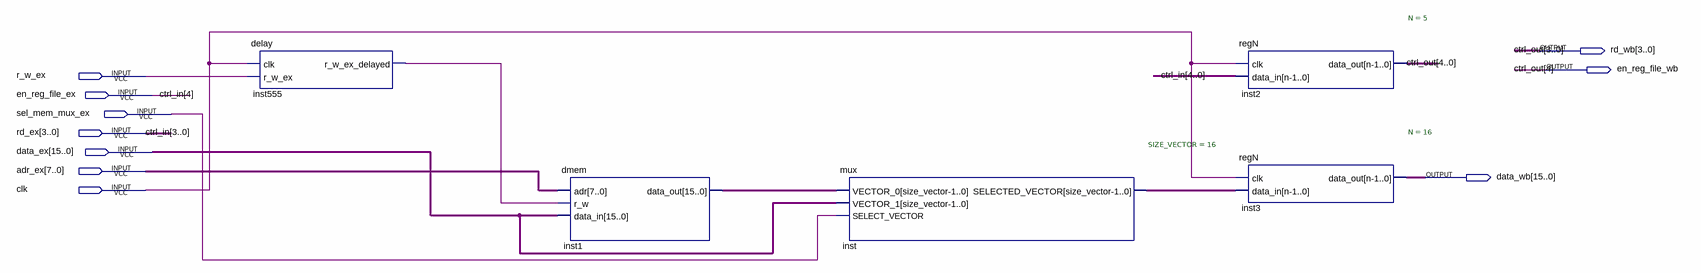
[diagram p0: schematic sheet]
// Quartus schematic Etage_MEM.bdf as structural Verilog: 5 symbols, 10 pins
module Etage_MEM (
  input  r_w_ex,
  input  en_reg_file_ex,
  input  sel_mem_mux_ex,
  input  [3:0] rd_ex,
  input  [15:0] data_ex,
  input  [7:0] adr_ex,
  input  clk,
  output [3:0] rd_wb,
  output en_reg_file_wb,
  output [15:0] data_wb
);

  wire inst555_r_w_ex_delayed;
  wire [15:0] inst1_data_out, inst_selected_vector;

  delay inst555 (.clk(clk), .r_w_ex(r_w_ex), .r_w_ex_delayed(inst555_r_w_ex_delayed));
  dmem inst1 (.adr(adr_ex), .r_w(inst555_r_w_ex_delayed), .data_in(data_ex), .data_out(inst1_data_out));
  mux #(.SIZE_VECTOR(16)) inst (
    .VECTOR_0(inst1_data_out), .VECTOR_1(data_ex), .SELECT_VECTOR(sel_mem_mux_ex),
    .SELECTED_VECTOR(inst_selected_vector));
  regN #(.N(5)) inst2 (.clk(clk), .data_in({en_reg_file_ex, rd_ex}), .data_out({en_reg_file_wb, rd_wb}));
  regN #(.N(16)) inst3 (.clk(clk), .data_in(inst_selected_vector), .data_out(data_wb));

  // Other names for the same wires on the sheet: ctrl_in[4:0] = {en_reg_file_ex, rd_ex};
  //   ctrl_out[4:0] = {en_reg_file_wb, rd_wb}
endmodule
